# Altium schematic sheet 6_USB-Socket.SchDoc
size A; SheetNumber: 7; SheetTotal: 7
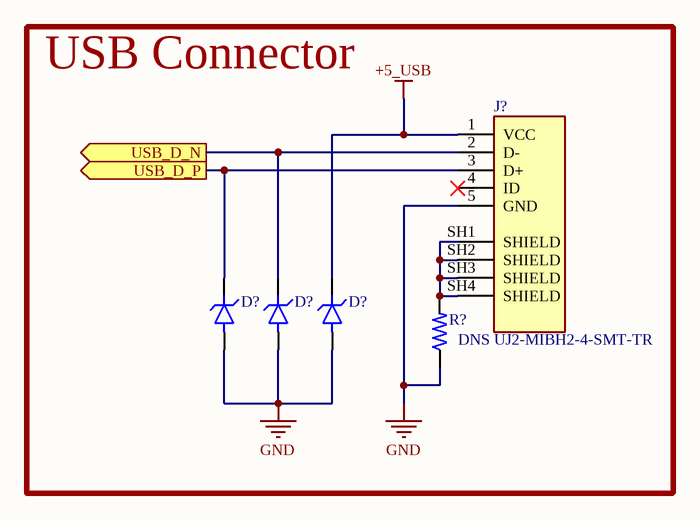
[diagram p0: 6_USB-Socket.SchDoc]

## Parts
(Parts that share a designator on the sheet are numbered #1, #2 ... from top to bottom, then left to right.)
D?#1  RCLAMP0521P.TCT  [RCLAMP0521P.TCT]  (value not drawn)
D?#2  RCLAMP0521P.TCT  [RCLAMP0521P.TCT]  (value not drawn)
D?#3  RCLAMP0521P.TCT  [RCLAMP0521P.TCT]  (value not drawn)
J?  UJ2-MIBH2-4-SMT-TR  [USB MICRO JLC]
R?  value DNS  [0402R]  (hidden comment: RES)

## Blocks framed on the sheet
USB Connector: D?#1-D?#3 J? R?

## Ports
USB_D_N (out, see 2_MCU-BLE[4B]), USB_D_P (out, see 2_MCU-BLE[4B])

## Nets
+5_USB: D?#3.K J?.1(VCC)
GND: D?#1.A D?#2.A D?#3.A J?.5(GND) R?.1
USB_D_N: D?#2.K J?.2(D-) ; port USB_D_N
USB_D_P: D?#1.K J?.3(D+) ; port USB_D_P
NetJ?_SH1: J?.SH1(SHIELD) J?.SH2(SHIELD) J?.SH3(SHIELD) J?.SH4(SHIELD) R?.2

Not connected (* = marked no-connect by the designer): J? 4(ID)*

## Library data of the parts
D?#1-D?#3 = TVS DIODE: 25V Clamp 4A (8/20µs) Ipp Tvs Diode Surface Mount SLP1006P2; MFR: Semtech Corporation; Type: SMD; MFR PN: RCLAMP0521P.TCT; Value: RCLAMP0521P.TCT
J? = Micro USB Port: Micro B, USB 2.0, 1.8 A, Right Angle, Surface Mount (SMT), USB Receptacle; MFR: CUI Devices; Value: UJ2-MIBH2-4-SMT-TR
R? = RES: Resistor; MFR PN: *; MFR: *; JLCPCB PN: *